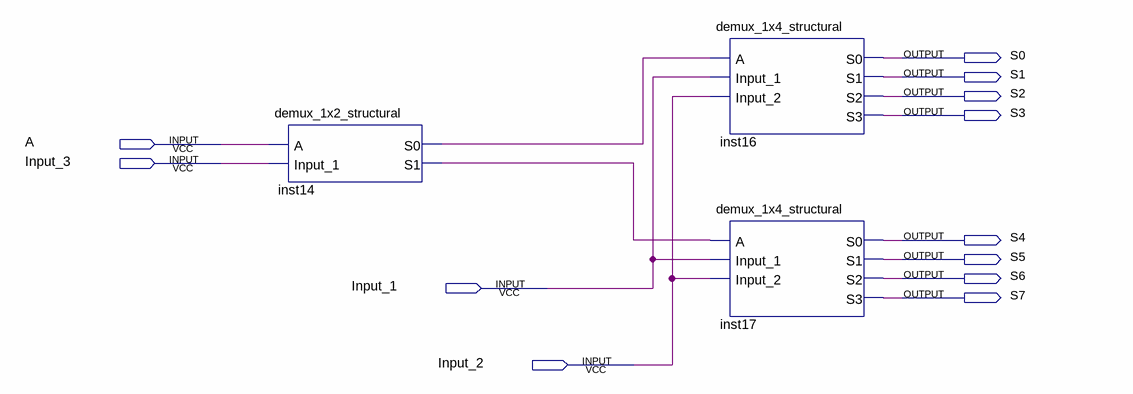
[diagram p0: schematic sheet]
// Quartus schematic demux_1x8_bycustomstruct.bdf as structural Verilog: 3 symbols, 12 pins
module demux_1x8_bycustomstruct (
  input  A,
  input  Input_3,
  input  Input_1,
  input  Input_2,
  output S0,
  output S1,
  output S2,
  output S3,
  output S4,
  output S5,
  output S6,
  output S7
);

  wire inst14_s0, inst14_s1;

  demux_1x2_structural inst14 (.A(A), .Input_1(Input_3), .S0(inst14_s0), .S1(inst14_s1));
  demux_1x4_structural inst16 (.A(inst14_s0), .Input_1(Input_1), .Input_2(Input_2), .S0(S0), .S1(S1), .S2(S2), .S3(S3));
  demux_1x4_structural inst17 (.A(inst14_s1), .Input_1(Input_1), .Input_2(Input_2), .S0(S4), .S1(S5), .S2(S6), .S3(S7));
endmodule
